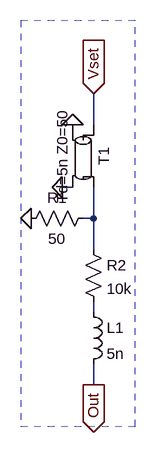
[diagram p0: schematic nBias.asc]
nBias.asc, the LTspice schematic file:
Version 4
SHEET 1 880 680
WIRE 80 -96 80 -144
WIRE 48 0 32 0
WIRE 80 48 80 0
WIRE 80 48 64 48
WIRE 80 96 80 48
WIRE 80 192 80 176
WIRE 80 304 80 272
FLAG -16 48 0
FLAG 48 -96 0
FLAG 32 0 0
FLAG 80 304 Out
IOPIN 80 304 Out
FLAG 80 -144 Vset
IOPIN 80 -144 In
SYMBOL tline 64 -48 R90
SYMATTR InstName T1
SYMATTR Value Td=5n Z0=50
SYMBOL res 80 32 R90
WINDOW 0 0 56 VBottom 2
WINDOW 3 32 56 VTop 2
SYMATTR InstName R1
SYMATTR Value 50
SYMBOL res 64 80 R0
SYMATTR InstName R2
SYMATTR Value 10k
SYMBOL ind 64 176 R0
SYMATTR InstName L1
SYMATTR Value 5n
RECTANGLE Normal -32 368 144 -256 2

The netlist it stands for:
* nBias.asc
T1 Vset 0 N001 0 Td=5n Z0=50
R1 N001 0 50
R2 N001 N002 10k
L1 N002 Out 5n
.backanno
.end